# Altium project Adafruit TCS34725.PrjPcb
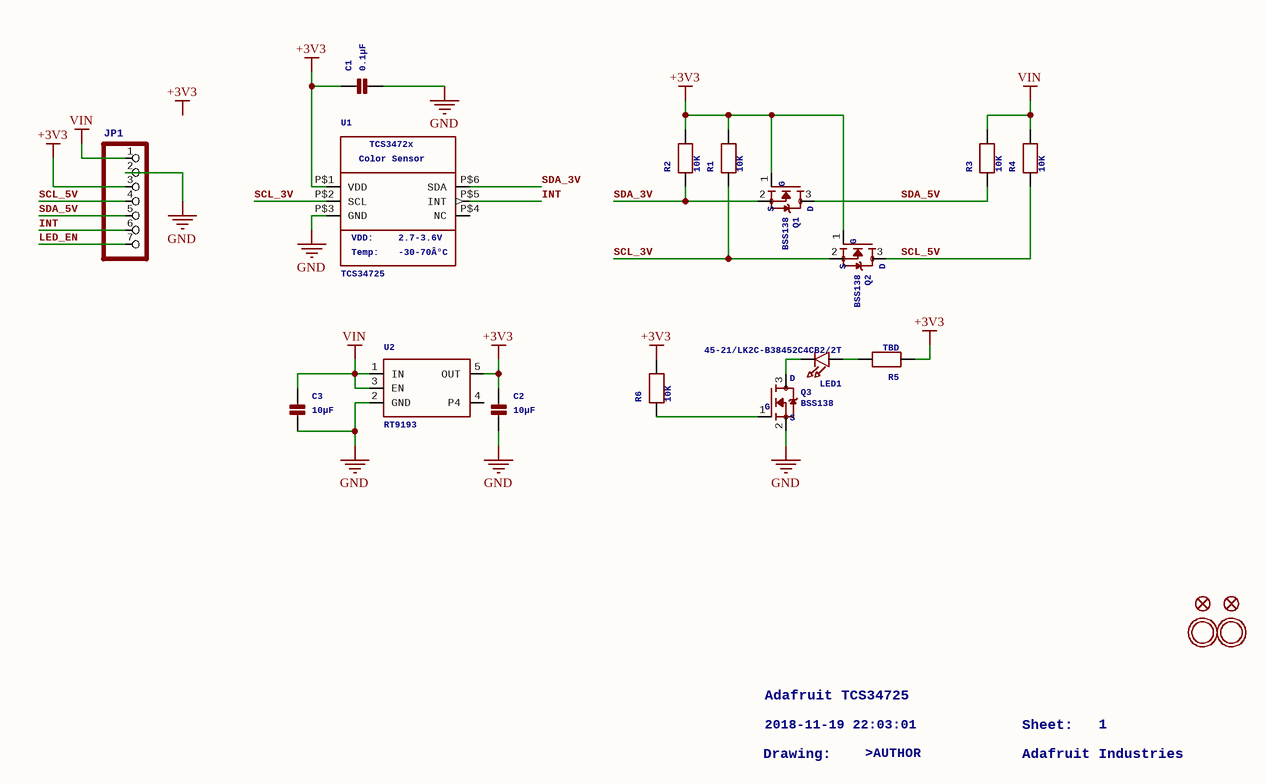
[diagram p0: Adafruit TCS34725.SchDoc]
1 sheet, 20 parts. Net scope: global (net labels, ports and power ports of the same name join across sheets).

## Sheet Adafruit TCS34725.SchDoc: Adafruit TCS34725
size 282 x 200 mm; Date: 2018-11-19 22:03:01; Author: >AUTHOR; SheetNumber: 1; GateName_1: G$1; SymbolName_1: FRAME_A4_ADAFRUIT; LibraryName: microbuilder; DeviceSetName: FRAME_A4_ADAFRUIT

### Parts
C1  0.1µF  [_0805]
C2  10µF  [_0805]
C3  10µF  [_0805]
FID1  FIDUCIAL""  [FIDUCIAL_1MM]  (value not drawn)
FID2  FIDUCIAL""  [FIDUCIAL_1MM]  (value not drawn)
JP1  HEADER-1X770MIL  [1X07_ROUND_70]  (value not drawn)
LED1  45-21/LK2C-B38452C4CB2/2T  [EVERLIGHT_45-21]
Q1  BSS138  [SOT23-WIDE]
Q2  BSS138  [SOT23-WIDE]
Q3  BSS138  [SOT23-WIDE]
R1  10K  [_0805]
R2  10K  [_0805]
R3  10K  [_0805]
R4  10K  [_0805]
R5  TBD  [_0805]
R6  10K  [_0805]
U1  TCS34725  ColorSensor: Color Sensor  VDD: VDD:  Temp: Temp:  [TCS3472_FN6]
U2  RT9193  [SOT23-5]
U$8  MOUNTINGHOLE2.5  [MOUNTINGHOLE_2.5_PLATED]  (value not drawn)
U$14  MOUNTINGHOLE2.5  [MOUNTINGHOLE_2.5_PLATED]  (value not drawn)

### Nets
+3V3: C1.1(P$1) C2.1(P$1) JP1.3 Q1.1(G) Q2.1(G) R1.2 R2.2 R5.1 R6.2 U1.P$1(VDD) U2.5(OUT)
GND: C1.2(P$2) C2.2(P$2) C3.2(P$2) JP1.2 Q3.2(S) U1.P$3(GND) U2.2(GND)
VIN: C3.1(P$1) JP1.1 R3.2 R4.2 U2.1(IN) U2.3(EN)
INT: JP1.6 U1.P$5(INT)
LED_EN: JP1.7
SCL_3V: Q2.2(S) R1.1 U1.P$2(SCL)
SCL_5V: JP1.4 Q2.3(D) R4.1
SDA_3V: Q1.2(S) R2.1 U1.P$6(SDA)
SDA_5V: JP1.5 Q1.3(D) R3.1
NetLED1_A: LED1.A R5.2
NetLED1_K: LED1.K(C) Q3.3(D)
NetQ3_1: Q3.1(G) R6.1

Not connected (* = marked no-connect by the designer): U1 P$4(NC); U2 4(P4)

### Notes on the sheet
- Adafruit TCS34725
- 2018-11-19 22:03:01
- Sheet:
- 1
- Drawing:
- >AUTHOR
- Adafruit Industries
- Labels drawn without touching a wire or pin: +3V3
- 2
- 3
- 4
- 5
- 6
- A
- B
- C
- D

### Library data of the parts
C1-C3 = CAP_CERAMIC_0805: Ceramic Capacitors0402 - 0402 Surface Mount Capacitors 0603 - 0603 Surface Mount Capacitors 0603 - RF Specific 0805 - 0805 Surface Mount Capacitors 1206 - 1206 Surface Mount Capacitors; GateName_1: G$1; SymbolName_1: CAPACITOR; DeviceName: _0805; LibraryName: microbuilder; DeviceSetName: CAP_CERAMIC
FID1 FID2 = FIDUCIAL"": Fiducial Alignment PointsVarious fiducial points for machine vision alignment.; GateName_1: G$1; DeviceName: ""; SymbolName_1: FIDUCIAL; LibraryName: microbuilder; DeviceSetName: FIDUCIAL
JP1 = HEADER-1X770MIL: PIN HEADER; GateName_1: A; SymbolName_1: PINHD7; DeviceName: 70MIL; LibraryName: microbuilder; DeviceSetName: HEADER-1X7
LED1 = LEDEV45-21: LED0603 - 0603 Surface Mount Package 2mA:5mA:0805 - 0805 Surface Mount Package 2mA:20mA:; GateName_1: G$1; SymbolName_1: LED; DeviceName: EV45-21; LibraryName: microbuilder; DeviceSetName: LED
Q1-Q3 = MOSFET-NWIDE: N-Channel MosfetLEGENDVDS: Voltage Drain-SourceID: Drain CurrentRDS(ON): Drain-Source On-State ResistanceVGS(TH): Gate-Source Threshold VoltageCISS: Drain-Source Input Capacitance SOT-23NameVDSIDRDS(ON)VGS(TH)CISSOrder Number2N7002E60V260mA2.5 Ohm2.5V @ 250uA26.7pF @ 25V2N7002ET1GOSTR-NDBSH10330V850mA400 mOhm400mV @ 1mA83pF @ 24VBSH103,235-NDBSS13860V320mA1.6 Ohm1.5V @ 250uA50pF @ 10VMouser: 771-BSS138PW115DMN2075U-720V4.2A38 mOhm1V @ 250 uA594.3pF @ 10VDMN2075U-7DICT-ND* BSS138 good choice for I2C level-shifting; GateName_1: G$1; DeviceName: WIDE; SymbolName_1: MOSFET-N; LibraryName: microbuilder; DeviceSetName: MOSFET-N; D: D; S: S; G: G
R1-R6 = RESISTOR_0805: Resistors0402 - 0402 Surface Mount Package 0603 - 0603 Surface Mount Package0805 - 0805 Surface Mount Package 1206 - 1206 Surface Mount Package2012 - 2010 Surface Mount Package; GateName_1: G$1; SymbolName_1: RESISTOR; DeviceName: _0805; LibraryName: microbuilder; DeviceSetName: RESISTOR
U1 = LIGHT_TCS3472: TCS3472 RGB + Clear Color SensorPart IDs; GateName_1: G$1; SymbolName_1: TCS3472; LibraryName: microbuilder; DeviceSetName: LIGHT_TCS3472; TCS3472x: TCS3472x; 2.7-3.6V: 2.7-3.6V; -30-70Â°C: -30-70Â°C
U2 = VREG_SOT23-5: SOT23-5 Fixed Voltage RegulatorsTo better organise some of the SOT23-5 fixed voltage regulators in this library, this new part was created.PartCurrent OutV OutV InV DropoutDigikey Part No.  ADP121  150mA  3.3V  3.4-5.5V  0.09V @ 150mA  ADP121-AUJZ33R7CT-ND  ADP121  150mA  3.0V  3.1-5.5V  0.09V @ 150mA  ADP121-AUJZ30R7CT-ND  ADP122     300mA  3.3V  3.4-5.5V  0.085V @ 300mA  ADP122AUJZ-3.3-R7CT-ND  ADP1712     300mA  3.3V  3.5-5.5V  0.17V @ 300mA  ADP1712AUJZ-3.3-R7TR-ND  AP7311 (Low Cost)  150mA  3.3V  3.5-6V  0.15V @ 150mA  AP7311-33WG-7DICT-ND  LD39015M18R  150mA  1.8V  1.9V-5.5V  0.08V @ 100mA  497-6977-1-ND  MCP1824T-3302E/OT  300mA  3.3V  3.5V-6V  0.2V @ 300mA  MCP1824T-3302E/OTCT-ND  MIC5205-2.5YM5 TR  150mA  2.5V  2.7-16V  0.165V @ 150mA  576-1257-2-ND  MIC5205-3.0YM5 TR  150mA  3.0V  3.2V-16V  0.165V @ 150mA  576-1258-2-ND  MIC5205-3.3YM5 TR  150mA  3.3V  3.5V-16V  0.165V @ 150mA  576-1259-2-ND  TPS780330220  150mA  3.3V+2.2V  3.6-5.5V  250mV Max  296-23332-1-ND  TDA3663/N1,135  100mA  3.3V  3.5-45V  0.18V @ 50mA  568-5343-1-ND; GateName_1: G$1; SymbolName_1: VREG_SOT23-5; LibraryName: microbuilder; DeviceSetName: VREG_SOT23-5
U$8 U$14 = MOUNTINGHOLE2.5: Mounting HoleFor #2 screws (0.086"/2.18mm width, 0.094"/2.4mm hole) use 2.5mm; GateName_1: G$1; DeviceName: 2.5; SymbolName_1: MOUNTINGHOLE; LibraryName: microbuilder; DeviceSetName: MOUNTINGHOLE